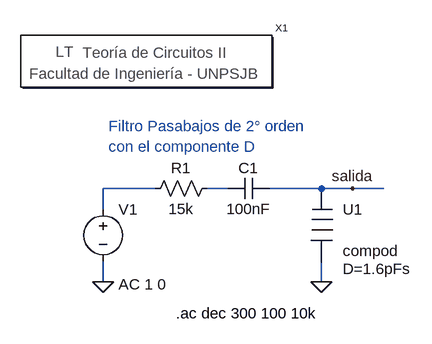
[diagram p0: schematic Filtro pasabajos con componente D.asc]
Filtro pasabajos con componente D.asc, the LTspice schematic file:
Version 4
SHEET 1 880 680
WIRE -16 128 -96 128
WIRE 96 128 64 128
WIRE 240 128 160 128
WIRE 288 128 240 128
WIRE 336 128 288 128
WIRE -96 160 -96 128
WIRE -96 272 -96 240
WIRE 240 272 240 240
FLAG 240 272 0
FLAG -96 272 0
FLAG 288 128 salida
SYMBOL compod 272 128 R0
WINDOW 3 1 124 Left 2
SYMATTR Value D=1.6pFs
SYMATTR InstName U1
SYMBOL res 80 112 R90
WINDOW 0 0 56 VBottom 2
WINDOW 3 32 56 VTop 2
SYMATTR InstName R1
SYMATTR Value 15k
SYMBOL cap 160 112 R90
WINDOW 0 0 32 VBottom 2
WINDOW 3 32 32 VTop 2
SYMATTR InstName C1
SYMATTR Value 100nF
SYMBOL voltage -96 144 R0
WINDOW 123 24 132 Left 2
WINDOW 39 0 0 Left 2
SYMATTR Value2 AC 1 0
SYMATTR InstName V1
SYMATTR Value ""
SYMBOL Teoría\ de\ Circuitos\ II -32 -64 R0
SYMATTR InstName X1
TEXT 16 320 Left 2 !.ac dec 300 100 10k
TEXT -88 32 Left 2 ;Filtro Pasabajos de 2° orden\ncon el componente D

The netlist it stands for:
* Filtro pasabajos con componente D.asc
XU1 salida 0 compod D=1.6pFs  ; pins 1 2
R1 N002 N001 15k
C1 salida N002 100nF
V1 N001 0 AC 1 0
XX1 Teoría de Circuitos II
.ac dec 300 100 10k
* Filtro Pasabajos de 2° orden
* con el componente D
.lib ..\sym\Circuitos2\ComponentesIdeales\compoideales.lib
.backanno
.end